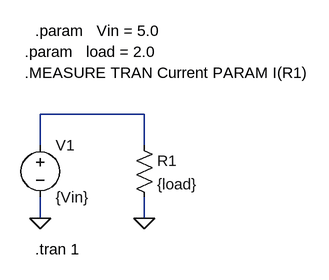
[diagram p0: schematic test1.asc]
test1.asc, the LTspice schematic file:
Version 4
SHEET 1 880 680
WIRE 240 64 80 64
WIRE 80 112 80 64
WIRE 240 112 240 64
WIRE 80 224 80 192
WIRE 240 224 240 192
FLAG 80 224 0
FLAG 240 224 0
SYMBOL voltage 80 96 R0
SYMATTR InstName V1
SYMATTR Value {Vin}
SYMBOL res 224 96 R0
SYMATTR InstName R1
SYMATTR Value {load}
TEXT 72 -64 Left 2 !.param   Vin = 5.0
TEXT 72 272 Left 2 !.tran 1
TEXT 56 0 Left 2 !.MEASURE TRAN Current PARAM I(R1)
TEXT 56 -32 Left 2 !.param   load = 2.0

The netlist it stands for:
* test1.asc
V1 N001 0 {Vin}
R1 N001 0 {load}
.param   Vin = 5.0
.tran 1
.MEASURE TRAN Current PARAM I(R1)
.param   load = 2.0
.backanno
.end